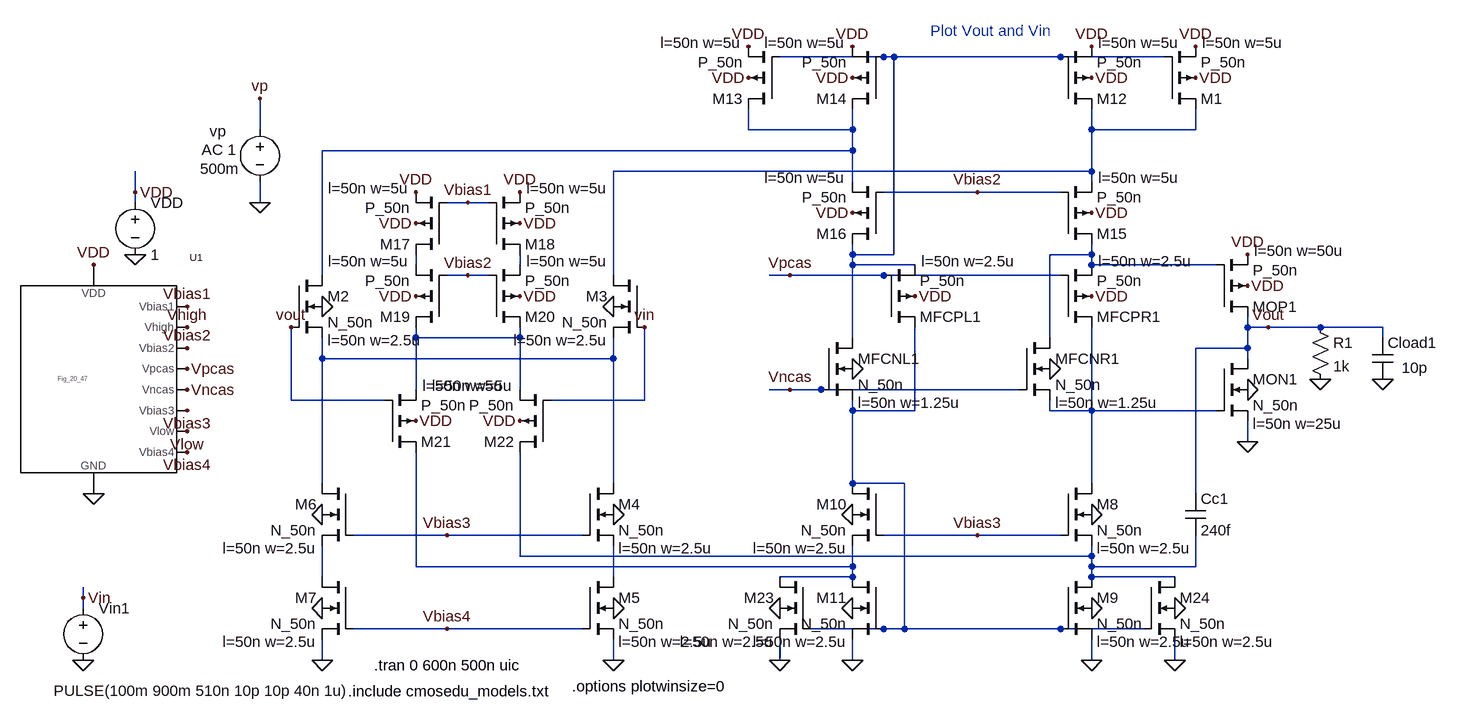
[diagram p0: schematic Fig24_49.asc]
Fig24_49.asc, the LTspice schematic file:
Version 4
SHEET 1 3380 680
WIRE 2512 -1184 2352 -1184
WIRE 2528 -1184 2512 -1184
WIRE 2784 -1184 2528 -1184
WIRE 2944 -1184 2784 -1184
WIRE 1552 -1072 1552 -1120
WIRE 2304 -1072 2304 -1104
WIRE 2464 -1072 2464 -1104
WIRE 2464 -1072 2304 -1072
WIRE 2832 -1072 2832 -1104
WIRE 2992 -1072 2992 -1104
WIRE 2992 -1072 2832 -1072
WIRE 2464 -1040 2464 -1072
WIRE 2464 -1040 1648 -1040
WIRE 2832 -1008 2832 -1072
WIRE 2832 -1008 2096 -1008
WIRE 2464 -992 2464 -1040
WIRE 2832 -992 2832 -1008
WIRE 1360 -976 1360 -1008
WIRE 2656 -976 2512 -976
WIRE 2784 -976 2656 -976
WIRE 1360 -960 1360 -976
WIRE 1552 -960 1552 -992
WIRE 1872 -960 1840 -960
WIRE 1904 -960 1872 -960
WIRE 2464 -880 2464 -896
WIRE 2528 -880 2528 -1184
WIRE 2528 -880 2464 -880
WIRE 2832 -880 2832 -896
WIRE 2832 -880 2768 -880
WIRE 1792 -864 1792 -880
WIRE 1952 -864 1952 -880
WIRE 2464 -864 2464 -880
WIRE 2560 -864 2464 -864
WIRE 2832 -864 2832 -880
WIRE 3024 -864 2832 -864
WIRE 1648 -848 1648 -1040
WIRE 1872 -848 1840 -848
WIRE 1904 -848 1872 -848
WIRE 2096 -848 2096 -1008
WIRE 2368 -848 2336 -848
WIRE 2512 -848 2368 -848
WIRE 2784 -848 2512 -848
WIRE 3072 -768 3072 -784
WIRE 3104 -768 3072 -768
WIRE 3184 -768 3104 -768
WIRE 3280 -768 3184 -768
WIRE 1792 -752 1792 -768
WIRE 1952 -752 1952 -768
WIRE 1952 -752 1792 -752
WIRE 2464 -752 2464 -864
WIRE 2768 -752 2768 -880
WIRE 3280 -752 3280 -768
WIRE 3072 -736 3072 -768
WIRE 3072 -736 2992 -736
WIRE 1648 -720 1648 -752
WIRE 2096 -720 2096 -752
WIRE 2096 -720 1648 -720
WIRE 3072 -720 3072 -736
WIRE 1792 -672 1792 -752
WIRE 1952 -672 1952 -752
WIRE 2368 -672 2336 -672
WIRE 2416 -672 2368 -672
WIRE 2720 -672 2416 -672
WIRE 1600 -656 1600 -768
WIRE 1744 -656 1600 -656
WIRE 2144 -656 2144 -768
WIRE 2144 -656 2000 -656
WIRE 2464 -640 2464 -656
WIRE 2560 -640 2560 -768
WIRE 2560 -640 2464 -640
WIRE 2768 -640 2768 -656
WIRE 2832 -640 2832 -768
WIRE 2832 -640 2768 -640
WIRE 3024 -640 2832 -640
WIRE 3072 -592 3072 -624
WIRE 1648 -528 1648 -720
WIRE 2096 -528 2096 -720
WIRE 2464 -528 2464 -640
WIRE 2544 -528 2464 -528
WIRE 2832 -528 2832 -640
WIRE 2992 -512 2992 -736
WIRE 1840 -448 1696 -448
WIRE 2048 -448 1840 -448
WIRE 2656 -448 2512 -448
WIRE 2784 -448 2656 -448
WIRE 1952 -416 1952 -576
WIRE 2832 -416 2832 -432
WIRE 2832 -416 1952 -416
WIRE 1792 -400 1792 -576
WIRE 2464 -400 2464 -432
WIRE 2464 -400 1792 -400
WIRE 2832 -400 2832 -416
WIRE 2992 -400 2992 -448
WIRE 2992 -400 2832 -400
WIRE 1648 -384 1648 -432
WIRE 2096 -384 2096 -432
WIRE 2464 -384 2464 -400
WIRE 2464 -384 2352 -384
WIRE 2832 -384 2832 -400
WIRE 2960 -384 2832 -384
WIRE 1280 -352 1280 -368
WIRE 1280 -336 1280 -352
WIRE 1840 -304 1696 -304
WIRE 2048 -304 1840 -304
WIRE 2512 -304 2400 -304
WIRE 2544 -304 2544 -528
WIRE 2544 -304 2512 -304
WIRE 2784 -304 2544 -304
WIRE 2912 -304 2784 -304
WIRE 1648 -256 1648 -288
WIRE 2096 -256 2096 -288
WIRE 2352 -256 2352 -288
WIRE 2464 -256 2464 -288
WIRE 2832 -256 2832 -288
WIRE 2960 -256 2960 -288
FLAG 1360 -880 0
FLAG 1360 -976 VDD
FLAG 1296 -864 VDD
FLAG 1296 -512 0
FLAG 1440 -800 Vbias1
FLAG 1440 -768 Vhigh
FLAG 1440 -736 Vbias2
FLAG 1440 -640 Vbias3
FLAG 1440 -704 Vpcas
FLAG 1440 -672 Vncas
FLAG 1440 -576 Vbias4
FLAG 1440 -608 Vlow
FLAG 1552 -960 0
FLAG 1552 -1120 vp
FLAG 1280 -256 0
FLAG 1280 -352 Vin
FLAG 2992 -1152 VDD
FLAG 1648 -800 0
FLAG 2096 -800 0
FLAG 1600 -768 vout
FLAG 2144 -768 vin
FLAG 2096 -480 0
FLAG 2096 -336 0
FLAG 2096 -256 0
FLAG 1648 -480 0
FLAG 1648 -336 0
FLAG 1648 -256 0
FLAG 1840 -448 Vbias3
FLAG 1840 -304 Vbias4
FLAG 2832 -480 0
FLAG 2832 -336 0
FLAG 2832 -256 0
FLAG 2464 -480 0
FLAG 2464 -336 0
FLAG 2464 -256 0
FLAG 2656 -448 Vbias3
FLAG 2832 -1152 VDD
FLAG 2832 -1200 VDD
FLAG 2992 -1200 VDD
FLAG 2304 -1152 VDD
FLAG 2464 -1152 VDD
FLAG 2464 -1200 VDD
FLAG 2304 -1200 VDD
FLAG 2832 -944 VDD
FLAG 2464 -944 VDD
FLAG 2656 -976 Vbias2
FLAG 3280 -688 0
FLAG 3104 -768 Vout
FLAG 2560 -816 VDD
FLAG 2832 -816 VDD
FLAG 2768 -704 0
FLAG 2464 -704 0
FLAG 2368 -848 Vpcas
FLAG 2368 -672 Vncas
FLAG 3072 -832 VDD
FLAG 3072 -880 VDD
FLAG 3072 -672 0
FLAG 3072 -592 0
FLAG 1792 -928 VDD
FLAG 1792 -976 VDD
FLAG 1952 -928 VDD
FLAG 1952 -976 VDD
FLAG 1792 -816 VDD
FLAG 1952 -816 VDD
FLAG 1872 -960 Vbias1
FLAG 1872 -848 Vbias2
FLAG 1792 -624 VDD
FLAG 1952 -624 VDD
FLAG 2352 -336 0
FLAG 2352 -256 0
FLAG 2960 -336 0
FLAG 2960 -256 0
FLAG 3184 -688 0
SYMBOL voltage 1360 -976 R0
WINDOW 123 0 0 Left 2
WINDOW 39 0 0 Left 2
SYMATTR InstName VDD
SYMATTR Value 1
SYMBOL Fig_20_47 1296 -688 R0
SYMATTR InstName U1
SYMBOL voltage 1552 -1088 R0
WINDOW 0 -77 18 Left 2
WINDOW 3 -92 76 Left 2
WINDOW 123 -90 47 Left 2
WINDOW 39 0 0 Left 2
SYMATTR InstName vp
SYMATTR Value 500m
SYMATTR Value2 AC 1
SYMBOL voltage 1280 -352 R0
WINDOW 3 -45 143 Left 2
WINDOW 123 0 0 Left 2
WINDOW 39 0 0 Left 2
SYMATTR Value PULSE(100m 900m 510n 10p 10p 40n 1u)
SYMATTR InstName Vin1
SYMBOL pmos4 2944 -1104 M180
WINDOW 123 58 102 Left 2
WINDOW 0 56 16 Left 2
SYMATTR Value2 l=50n w=5u
SYMATTR InstName M1
SYMATTR Value P_50n
SYMBOL nmos4 1600 -848 R0
WINDOW 123 56 100 Left 2
SYMATTR Value2 l=50n w=2.5u
SYMATTR InstName M2
SYMATTR Value N_50n
SYMBOL nmos4 2144 -848 M0
WINDOW 123 56 100 Left 2
SYMATTR Value2 l=50n w=2.5u
SYMATTR InstName M3
SYMATTR Value N_50n
SYMBOL nmos4 2048 -528 R0
WINDOW 123 56 100 Left 2
SYMATTR Value2 l=50n w=2.5u
SYMATTR InstName M4
SYMATTR Value N_50n
SYMBOL nmos4 2048 -384 R0
WINDOW 123 56 100 Left 2
SYMATTR Value2 l=50n w=2.5u
SYMATTR InstName M5
SYMATTR Value N_50n
SYMBOL nmos4 1696 -528 M0
WINDOW 123 56 100 Left 2
SYMATTR Value2 l=50n w=2.5u
SYMATTR InstName M6
SYMATTR Value N_50n
SYMBOL nmos4 1696 -384 M0
WINDOW 123 56 100 Left 2
SYMATTR Value2 l=50n w=2.5u
SYMATTR InstName M7
SYMATTR Value N_50n
SYMBOL nmos4 2784 -528 R0
WINDOW 123 56 100 Left 2
SYMATTR Value2 l=50n w=2.5u
SYMATTR InstName M8
SYMATTR Value N_50n
SYMBOL nmos4 2784 -384 R0
WINDOW 123 56 100 Left 2
SYMATTR Value2 l=50n w=2.5u
SYMATTR InstName M9
SYMATTR Value N_50n
SYMBOL nmos4 2512 -528 M0
WINDOW 123 56 100 Left 2
SYMATTR Value2 l=50n w=2.5u
SYMATTR InstName M10
SYMATTR Value N_50n
SYMBOL nmos4 2512 -384 M0
WINDOW 123 56 100 Left 2
SYMATTR Value2 l=50n w=2.5u
SYMATTR InstName M11
SYMATTR Value N_50n
SYMBOL pmos4 2784 -1104 M180
WINDOW 123 58 102 Left 2
WINDOW 0 56 16 Left 2
SYMATTR Value2 l=50n w=5u
SYMATTR InstName M12
SYMATTR Value P_50n
SYMBOL pmos4 2352 -1104 R180
WINDOW 123 58 102 Left 2
WINDOW 0 56 16 Left 2
SYMATTR Value2 l=50n w=5u
SYMATTR InstName M13
SYMATTR Value P_50n
SYMBOL pmos4 2512 -1104 R180
WINDOW 123 58 102 Left 2
WINDOW 0 56 16 Left 2
SYMATTR Value2 l=50n w=5u
SYMATTR InstName M14
SYMATTR Value P_50n
SYMBOL pmos4 2784 -896 M180
WINDOW 123 58 102 Left 2
WINDOW 0 56 16 Left 2
SYMATTR Value2 l=50n w=5u
SYMATTR InstName M15
SYMATTR Value P_50n
SYMBOL pmos4 2512 -896 R180
WINDOW 123 58 102 Left 2
WINDOW 0 56 16 Left 2
SYMATTR Value2 l=50n w=5u
SYMATTR InstName M16
SYMATTR Value P_50n
SYMBOL cap 3264 -752 R0
WINDOW 3 45 46 Left 2
SYMATTR Value 10p
SYMATTR InstName Cload1
SYMBOL pmos4 2512 -768 M180
WINDOW 123 58 102 Left 2
WINDOW 0 56 16 Left 2
SYMATTR Value2 l=50n w=2.5u
SYMATTR InstName MFCPL1
SYMATTR Value P_50n
SYMBOL pmos4 2784 -768 M180
WINDOW 123 58 102 Left 2
WINDOW 0 56 16 Left 2
SYMATTR Value2 l=50n w=2.5u
SYMATTR InstName MFCPR1
SYMATTR Value P_50n
SYMBOL nmos4 2720 -752 R0
WINDOW 123 56 100 Left 2
SYMATTR Value2 l=50n w=1.25u
SYMATTR InstName MFCNR1
SYMATTR Value N_50n
SYMBOL nmos4 2416 -752 R0
WINDOW 123 56 100 Left 2
SYMATTR Value2 l=50n w=1.25u
SYMATTR InstName MFCNL1
SYMATTR Value N_50n
SYMBOL pmos4 3024 -784 M180
WINDOW 123 58 102 Left 2
WINDOW 0 56 16 Left 2
SYMATTR Value2 l=50n w=50u
SYMATTR InstName MOP1
SYMATTR Value P_50n
SYMBOL nmos4 3024 -720 R0
WINDOW 123 56 100 Left 2
SYMATTR Value2 l=50n w=25u
SYMATTR InstName MON1
SYMATTR Value N_50n
SYMBOL cap 2976 -512 R0
SYMATTR InstName Cc1
SYMATTR Value 240f
SYMBOL pmos4 1840 -880 R180
WINDOW 123 58 102 Left 2
WINDOW 0 56 16 Left 2
SYMATTR Value2 l=50n w=5u
SYMATTR InstName M17
SYMATTR Value P_50n
SYMBOL pmos4 1904 -880 M180
WINDOW 123 58 102 Left 2
WINDOW 0 56 16 Left 2
SYMATTR Value2 l=50n w=5u
SYMATTR InstName M18
SYMATTR Value P_50n
SYMBOL pmos4 1840 -768 R180
WINDOW 123 58 102 Left 2
WINDOW 0 56 16 Left 2
SYMATTR Value2 l=50n w=5u
SYMATTR InstName M19
SYMATTR Value P_50n
SYMBOL pmos4 1904 -768 M180
WINDOW 123 58 102 Left 2
WINDOW 0 56 16 Left 2
SYMATTR Value2 l=50n w=5u
SYMATTR InstName M20
SYMATTR Value P_50n
SYMBOL pmos4 1744 -576 M180
WINDOW 123 58 102 Left 2
WINDOW 0 56 16 Left 2
SYMATTR Value2 l=50n w=5u
SYMATTR InstName M21
SYMATTR Value P_50n
SYMBOL pmos4 2000 -576 R180
WINDOW 123 58 102 Left 2
WINDOW 0 56 16 Left 2
SYMATTR Value2 l=50n w=5u
SYMATTR InstName M22
SYMATTR Value P_50n
SYMBOL nmos4 2400 -384 M0
WINDOW 123 56 100 Left 2
SYMATTR Value2 l=50n w=2.5u
SYMATTR InstName M23
SYMATTR Value N_50n
SYMBOL nmos4 2912 -384 R0
WINDOW 123 56 100 Left 2
SYMATTR Value2 l=50n w=2.5u
SYMATTR InstName M24
SYMATTR Value N_50n
SYMBOL res 3168 -784 R0
SYMATTR InstName R1
SYMATTR Value 1k
TEXT 1688 -208 Left 2 !.include cmosedu_models.txt
TEXT 1728 -248 Left 2 !.tran 0 600n 500n uic
TEXT 2584 -1224 Left 2 ;Plot Vout and Vin
TEXT 2032 -216 Left 2 !.options plotwinsize=0

The netlist it stands for:
* Fig24_49.asc
VDD VDD 0 1
XU1 Vbias1 Vhigh Vbias2 Vpcas Vncas Vbias3 Vlow Vbias4 VDD 0 Fig_20_47  ; pins Vbias1 Vhigh Vbias2 Vpcas Vncas Vbias3 Vlow Vbias4 VDD GND
vp vp 0 500m AC 1
Vin1 Vin 0 PULSE(100m 900m 510n 10p 10p 40n 1u)
M1 N003 N001 VDD VDD P_50n l=50n w=5u
M2 N002 vout N008 0 N_50n l=50n w=2.5u
M3 N003 Vin N008 0 N_50n l=50n w=2.5u
M4 N008 Vbias3 N014 0 N_50n l=50n w=2.5u
M5 N014 Vbias4 0 0 N_50n l=50n w=2.5u
M6 N008 Vbias3 N013 0 N_50n l=50n w=2.5u
M7 N013 Vbias4 0 0 N_50n l=50n w=2.5u
M8 N010 Vbias3 N011 0 N_50n l=50n w=2.5u
M9 N011 N009 0 0 N_50n l=50n w=2.5u
M10 N009 Vbias3 N012 0 N_50n l=50n w=2.5u
M11 N012 N009 0 0 N_50n l=50n w=2.5u
M12 N003 N001 VDD VDD P_50n l=50n w=5u
M13 N002 N001 VDD VDD P_50n l=50n w=5u
M14 N002 N001 VDD VDD P_50n l=50n w=5u
M15 N004 Vbias2 N003 VDD P_50n l=50n w=5u
M16 N001 Vbias2 N002 VDD P_50n l=50n w=5u
Cload1 vout 0 10p
MFCPL1 N009 Vpcas N001 VDD P_50n l=50n w=2.5u
MFCPR1 N010 Vpcas N004 VDD P_50n l=50n w=2.5u
MFCNR1 N004 Vncas N010 0 N_50n l=50n w=1.25u
MFCNL1 N001 Vncas N009 0 N_50n l=50n w=1.25u
MOP1 vout N004 VDD VDD P_50n l=50n w=50u
MON1 vout N010 0 0 N_50n l=50n w=25u
Cc1 vout N011 240f
M17 N005 Vbias1 VDD VDD P_50n l=50n w=5u
M18 N006 Vbias1 VDD VDD P_50n l=50n w=5u
M19 N007 Vbias2 N005 VDD P_50n l=50n w=5u
M20 N007 Vbias2 N006 VDD P_50n l=50n w=5u
M21 N012 vout N007 VDD P_50n l=50n w=5u
M22 N011 Vin N007 VDD P_50n l=50n w=5u
M23 N012 N009 0 0 N_50n l=50n w=2.5u
M24 N011 N009 0 0 N_50n l=50n w=2.5u
R1 vout 0 1k
.model NMOS NMOS
.model PMOS PMOS
.lib standard.mos
.include cmosedu_models.txt
.tran 0 600n 500n uic
* Plot Vout and Vin
.options plotwinsize=0
.backanno
.end